# EAGLE design Si5504DC breakout (EAGLE 6.1)
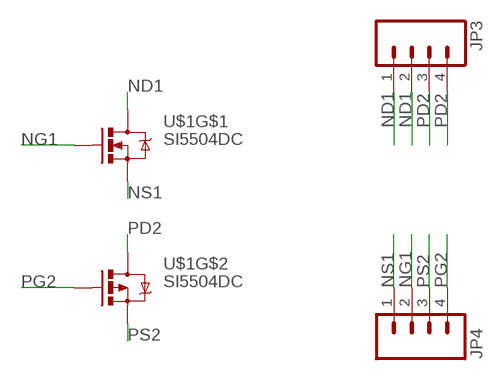
[diagram p0: schematic, sheet 1]

## Parts
JP3  M04LOCK  [1X04_LOCK]
JP4  M04LOCK  [1X04_LOCK]
U$1  SI5504DC  [1206-8]

## Nets
ND1: JP3.1 JP3.2 U$1.P$7(D) U$1.P$8(D)
NG1: JP4.2 U$1.P$2(G)
NS1: JP4.1 U$1.P$1(S)
PD2: JP3.3 JP3.4 U$1.P$5(D) U$1.P$6(D)
PG2: JP4.4 U$1.P$4(G)
PS2: JP4.3 U$1.P$3(S)

## Library data of the parts
JP3 JP4 = SparkFun-Connectors:M04: Header 4 Standard 4-pin 0.1" header. Use with straight break away headers (SKU : PRT-00116), right angle break away headers (PRT-00553), swiss pins (PRT-00743), machine pins (PRT-00117), and female headers (PRT-00115). Molex polarized connector foot print use with SKU : PRT-08231 with associated crimp pins and housings. 1MM SMD Version SKU: PRT-10208
U$1 = Railstars:SI5504DC

## Board
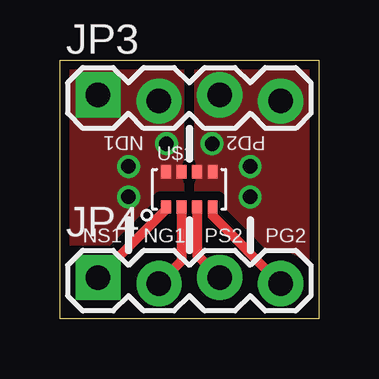
[diagram p1: board, top side]
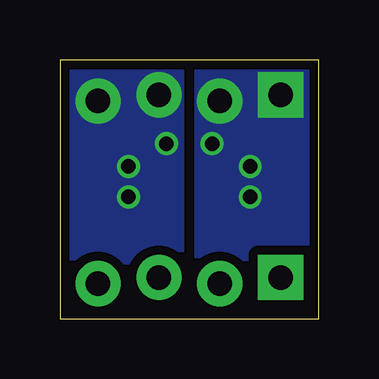
[diagram p2: board, bottom side, seen from below]

Size 10.79 x 10.79 mm. Coordinates in mm from the lower left corner, seen from the top.
Outline: 0,10.79 10.79,10.79 10.79,0 0,0 0,10.79
Copper layers (1*16): Top 0.0356mm / dielectric 1.5011mm / Bottom 0.0356mm
Design rules: minimum track width 6mil, minimum drill 13mil, track to track 6mil, track to pad 6mil, pad to pad 6mil, via to via 6mil, smd to smd 6mil, copper to edge 15mil, drill to drill 6mil, minimum pad ring 7mil, minimum via ring 7mil, stop-mask expansion 4mil, vias tented up to drill 100mil, thermal gap 10mil

### Footprints (pad centres in the part's own frame; a part is rotated, then mirrored left to right if it is on the bottom)
1X04_LOCK = drill 1.016 pad 1.88 square: 1 0,0.127 | drill 1.016 pad 1.88: 2 2.54,-0.127; 3 5.08,0.127; 4 7.62,-0.127
1206-8 = smd 0.406 x 0.559: P$1 -0.975,-0.737; P$2 -0.325,-0.737; P$3 0.325,-0.737; P$4 0.975,-0.737; P$5 0.975,0.737; P$6 0.325,0.737; P$7 -0.325,0.737; P$8 -0.975,0.737

### Placement (x,y rotation side)
JP3  1.59,9.21 0 top
JP4  1.59,1.59 0 top
U$1  5.4,5.4 0 top

### Tracks (layer width: path | path; a pad name or v marks a point on that pad's centre or on a via)
ND1  (via drill 0.6)
  other vias: 4.45,7.3 2.86,6.35 2.86,5.08
  pour Top (isolate 0.381, no thermals): 0.32,0.32 0.32,10.48 5.02,10.48 5.02,0.32
  pour Bottom (isolate 0.381, no thermals): 0.32,10.48 5.02,10.48 5.02,0.32 0.32,0.32
NG1
  Top 0.406: U$1.P$2 5.07,2.41 JP4.2
NS1
  Top 0.406: U$1.P$1 4.42,4.55 JP4.1
PD2  (via drill 0.6)
  other vias: 6.35,7.3 7.94,6.35 7.94,5.08
  pour Top (isolate 0.381, no thermals): 5.78,0.32 5.78,10.48 10.48,10.48 10.48,0.32
  pour Bottom (isolate 0.381, no thermals): 5.78,10.48 10.48,10.48 10.48,0.32 5.78,0.32
PG2
  Top 0.406: U$1.P$4 6.37,4.3 JP4.4
PS2
  Top 0.406: U$1.P$3 5.72,2.66 JP4.3

### Text on the board
tPlace: ND1 | PD2 | NS1 | NG1 | PS2 | PG2